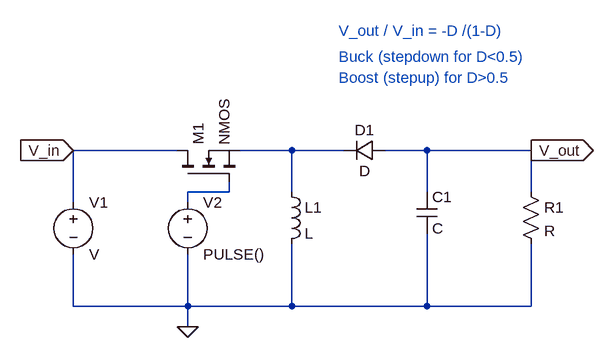
[diagram p0: schematic BuckBoostDCDCfixed.asc]
BuckBoostDCDCfixed.asc, the LTspice schematic file:
Version 4
SHEET 1 880 680
WIRE -64 64 -224 64
WIRE 112 64 32 64
WIRE 192 64 112 64
WIRE 320 64 256 64
WIRE 480 64 320 64
WIRE 16 128 16 112
WIRE 16 128 -48 128
WIRE 112 128 112 64
WIRE 320 128 320 64
WIRE 480 128 480 64
WIRE -224 144 -224 64
WIRE -48 144 -48 128
WIRE -224 304 -224 224
WIRE -48 304 -48 224
WIRE -48 304 -224 304
WIRE 112 304 112 208
WIRE 112 304 -48 304
WIRE 320 304 320 192
WIRE 320 304 112 304
WIRE 480 304 480 208
WIRE 480 304 320 304
WIRE -48 336 -48 304
FLAG -48 336 0
FLAG -224 64 V_in
IOPIN -224 64 In
FLAG 480 64 V_out
IOPIN 480 64 Out
SYMBOL ind 96 112 R0
SYMATTR InstName L1
SYMBOL diode 256 48 R90
WINDOW 0 0 32 VBottom 2
WINDOW 3 32 32 VTop 2
SYMATTR InstName D1
SYMBOL cap 304 128 R0
SYMATTR InstName C1
SYMBOL res 464 112 R0
SYMATTR InstName R1
SYMBOL nmos -64 112 R270
SYMATTR InstName M1
SYMBOL voltage -224 128 R0
SYMATTR InstName V1
SYMBOL voltage -48 128 R0
WINDOW 123 0 0 Left 0
WINDOW 39 0 0 Left 0
SYMATTR InstName V2
SYMATTR Value PULSE()
TEXT 184 -120 Left 2 ;V_out / V_in = -D /(1-D)
TEXT 184 -80 Left 2 ;Buck (stepdown for D<0.5)
TEXT 184 -48 Left 2 ;Boost (stepup) for D>0.5

The netlist it stands for:
* BuckBoostDCDCfixed.asc
L1 N001 0 L
D1 V_out N001 D
C1 V_out 0 C
R1 V_out 0 R
M1 V_in N002 N001 N001 NMOS
V1 V_in 0 V
V2 N002 0 PULSE()
.model D D
.lib standard.dio
.model NMOS NMOS
.model PMOS PMOS
.lib standard.mos
* V_out / V_in = -D /(1-D)
* Buck (stepdown for D<0.5)
* Boost (stepup) for D>0.5
.backanno
.end